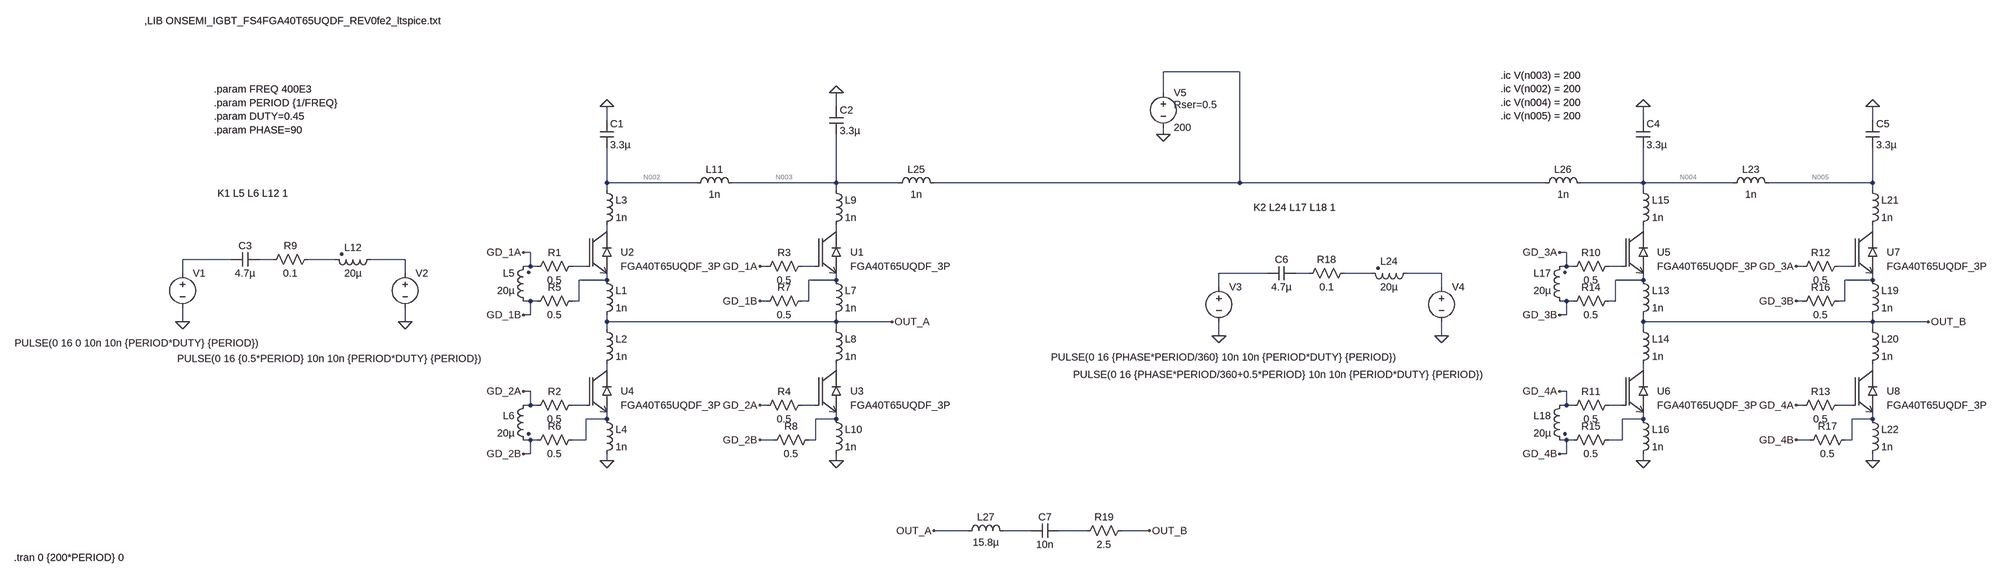
[diagram p0: schematic inverter.asc]
inverter.asc, the LTspice schematic file:
Version 4
SHEET 1 2984 848
WIRE 1264 -304 1088 -304
WIRE 1088 -256 1088 -304
WIRE 336 -224 336 -256
WIRE -192 -192 -192 -224
WIRE 2192 -192 2192 -224
WIRE 2720 -192 2720 -224
WIRE 1088 -160 1088 -176
WIRE -192 -48 -192 -128
WIRE 16 -48 -192 -48
WIRE 336 -48 336 -160
WIRE 336 -48 96 -48
WIRE 480 -48 336 -48
WIRE 1264 -48 1264 -304
WIRE 1264 -48 560 -48
WIRE 1968 -48 1264 -48
WIRE 2192 -48 2192 -128
WIRE 2192 -48 2048 -48
WIRE 2400 -48 2192 -48
WIRE 2720 -48 2720 -128
WIRE 2720 -48 2480 -48
WIRE -192 -32 -192 -48
WIRE 336 -32 336 -48
WIRE 2192 -32 2192 -48
WIRE 2720 -32 2720 -48
WIRE -192 64 -192 48
WIRE 336 64 336 48
WIRE 2192 64 2192 48
WIRE 2720 64 2720 48
WIRE -368 112 -384 112
WIRE 2016 112 2000 112
WIRE -1056 128 -1168 128
WIRE -960 128 -992 128
WIRE -816 128 -880 128
WIRE -656 128 -736 128
WIRE -368 144 -368 112
WIRE -368 144 -384 144
WIRE -352 144 -368 144
WIRE -240 144 -272 144
WIRE 176 144 160 144
WIRE 288 144 256 144
WIRE 2016 144 2016 112
WIRE 2016 144 2000 144
WIRE 2032 144 2016 144
WIRE 2144 144 2112 144
WIRE 2560 144 2544 144
WIRE 2672 144 2640 144
WIRE -1168 160 -1168 128
WIRE -656 160 -656 128
WIRE 1328 160 1216 160
WIRE 1424 160 1392 160
WIRE 1568 160 1504 160
WIRE 1728 160 1648 160
WIRE -192 176 -192 160
WIRE -192 176 -256 176
WIRE 336 176 336 160
WIRE 336 176 272 176
WIRE 2192 176 2192 160
WIRE 2192 176 2128 176
WIRE 2720 176 2720 160
WIRE 2720 176 2656 176
WIRE 1216 192 1216 160
WIRE 1728 192 1728 160
WIRE -368 224 -384 224
WIRE -352 224 -368 224
WIRE -256 224 -256 176
WIRE -256 224 -272 224
WIRE 176 224 160 224
WIRE 272 224 272 176
WIRE 272 224 256 224
WIRE 2016 224 2000 224
WIRE 2032 224 2016 224
WIRE 2128 224 2128 176
WIRE 2128 224 2112 224
WIRE 2560 224 2544 224
WIRE 2656 224 2656 176
WIRE 2656 224 2640 224
WIRE -368 256 -368 224
WIRE -368 256 -384 256
WIRE 2016 256 2016 224
WIRE 2016 256 2000 256
WIRE -1168 272 -1168 240
WIRE -656 272 -656 240
WIRE -192 272 -192 256
WIRE 336 272 336 256
WIRE 336 272 -192 272
WIRE 464 272 336 272
WIRE 2192 272 2192 256
WIRE 2720 272 2720 256
WIRE 2720 272 2192 272
WIRE 2848 272 2720 272
WIRE -192 288 -192 272
WIRE 336 288 336 272
WIRE 2192 288 2192 272
WIRE 2720 288 2720 272
WIRE 1216 304 1216 272
WIRE 1728 304 1728 272
WIRE -192 384 -192 368
WIRE 336 384 336 368
WIRE 2192 384 2192 368
WIRE 2720 384 2720 368
WIRE -368 432 -384 432
WIRE 2016 432 2000 432
WIRE -368 464 -368 432
WIRE -368 464 -384 464
WIRE -352 464 -368 464
WIRE -240 464 -272 464
WIRE 176 464 160 464
WIRE 288 464 256 464
WIRE 2016 464 2016 432
WIRE 2016 464 2000 464
WIRE 2032 464 2016 464
WIRE 2144 464 2112 464
WIRE 2560 464 2544 464
WIRE 2672 464 2640 464
WIRE -192 496 -192 480
WIRE -192 496 -240 496
WIRE 336 496 336 480
WIRE 336 496 288 496
WIRE 2192 496 2192 480
WIRE 2192 496 2144 496
WIRE 2720 496 2720 480
WIRE 2720 496 2672 496
WIRE -368 544 -384 544
WIRE -352 544 -368 544
WIRE -240 544 -240 496
WIRE -240 544 -272 544
WIRE 192 544 160 544
WIRE 288 544 288 496
WIRE 288 544 272 544
WIRE 2016 544 2000 544
WIRE 2032 544 2016 544
WIRE 2144 544 2144 496
WIRE 2144 544 2112 544
WIRE 2576 544 2544 544
WIRE 2672 544 2672 496
WIRE 2672 544 2656 544
WIRE -368 576 -368 544
WIRE -368 576 -384 576
WIRE 2016 576 2016 544
WIRE 2016 576 2000 576
WIRE -192 592 -192 576
WIRE 336 592 336 576
WIRE 2192 592 2192 576
WIRE 2720 592 2720 576
WIRE 640 768 560 768
WIRE 784 768 720 768
WIRE 912 768 848 768
WIRE 1056 768 992 768
FLAG -192 -224 0
FLAG -192 592 0
FLAG -384 112 GD_1A
FLAG -384 256 GD_1B
FLAG -384 432 GD_2A
FLAG -384 576 GD_2B
FLAG 336 -256 0
FLAG 336 592 0
FLAG 160 144 GD_1A
FLAG 160 224 GD_1B
FLAG 160 464 GD_2A
FLAG 160 544 GD_2B
FLAG -1168 272 0
FLAG -656 272 0
FLAG 2192 -224 0
FLAG 2192 592 0
FLAG 2000 112 GD_3A
FLAG 2000 256 GD_3B
FLAG 2000 432 GD_4A
FLAG 2000 576 GD_4B
FLAG 2720 -224 0
FLAG 2720 592 0
FLAG 2544 144 GD_3A
FLAG 2544 224 GD_3B
FLAG 2544 464 GD_4A
FLAG 2544 544 GD_4B
FLAG 1216 304 0
FLAG 1728 304 0
FLAG 464 272 OUT_A
FLAG 2848 272 OUT_B
FLAG 1088 -160 0
FLAG 560 768 OUT_A
FLAG 1056 768 OUT_B
SYMBOL FGA40T65UQDF_3P -240 144 R0
SYMATTR InstName U2
SYMBOL FGA40T65UQDF_3P -240 464 R0
SYMATTR InstName U4
SYMBOL ind -208 160 R0
SYMATTR InstName L1
SYMATTR Value 1n
SYMBOL ind -208 272 R0
SYMATTR InstName L2
SYMATTR Value 1n
SYMBOL ind -208 -48 R0
SYMATTR InstName L3
SYMATTR Value 1n
SYMBOL ind -208 480 R0
SYMATTR InstName L4
SYMATTR Value 1n
SYMBOL res -256 128 R90
WINDOW 0 0 56 VBottom 2
WINDOW 3 32 56 VTop 2
SYMATTR InstName R1
SYMATTR Value 0.5
SYMBOL res -256 448 R90
WINDOW 0 0 56 VBottom 2
WINDOW 3 32 56 VTop 2
SYMATTR InstName R2
SYMATTR Value 0.5
SYMBOL ind2 -368 240 R180
WINDOW 0 36 80 Left 2
WINDOW 3 36 40 Left 2
SYMATTR InstName L5
SYMATTR Value 20µ
SYMATTR Type ind
SYMBOL ind2 -368 448 M0
SYMATTR InstName L6
SYMATTR Value 20µ
SYMATTR Type ind
SYMBOL cap -208 -192 R0
SYMATTR InstName C1
SYMATTR Value 3.3µ
SYMATTR SpiceLine Rser=12.4m Lser=21n
SYMBOL FGA40T65UQDF_3P 288 144 R0
SYMATTR InstName U1
SYMBOL FGA40T65UQDF_3P 288 464 R0
SYMATTR InstName U3
SYMBOL ind 320 160 R0
SYMATTR InstName L7
SYMATTR Value 1n
SYMBOL ind 320 272 R0
SYMATTR InstName L8
SYMATTR Value 1n
SYMBOL ind 320 -48 R0
SYMATTR InstName L9
SYMATTR Value 1n
SYMBOL ind 320 480 R0
SYMATTR InstName L10
SYMATTR Value 1n
SYMBOL res 272 128 R90
WINDOW 0 0 56 VBottom 2
WINDOW 3 32 56 VTop 2
SYMATTR InstName R3
SYMATTR Value 0.5
SYMBOL res 272 448 R90
WINDOW 0 0 56 VBottom 2
WINDOW 3 32 56 VTop 2
SYMATTR InstName R4
SYMATTR Value 0.5
SYMBOL cap 320 -224 R0
SYMATTR InstName C2
SYMATTR Value 3.3µ
SYMATTR SpiceLine Rser=12.4m Lser=21n
SYMBOL res -256 208 R90
WINDOW 0 0 56 VBottom 2
WINDOW 3 32 56 VTop 2
SYMATTR InstName R5
SYMATTR Value 0.5
SYMBOL res -256 528 R90
WINDOW 0 0 56 VBottom 2
WINDOW 3 32 56 VTop 2
SYMATTR InstName R6
SYMATTR Value 0.5
SYMBOL res 272 208 R90
WINDOW 0 0 56 VBottom 2
WINDOW 3 32 56 VTop 2
SYMATTR InstName R7
SYMATTR Value 0.5
SYMBOL res 288 528 R90
WINDOW 0 0 56 VBottom 2
WINDOW 3 32 56 VTop 2
SYMATTR InstName R8
SYMATTR Value 0.5
SYMBOL ind 0 -32 R270
WINDOW 0 32 56 VTop 2
WINDOW 3 5 56 VBottom 2
SYMATTR InstName L11
SYMATTR Value 1n
SYMBOL ind2 -720 112 R90
WINDOW 0 4 56 VBottom 2
WINDOW 3 32 56 VTop 2
SYMATTR InstName L12
SYMATTR Value 20µ
SYMATTR Type ind
SYMBOL res -864 112 R90
WINDOW 0 0 56 VBottom 2
WINDOW 3 32 56 VTop 2
SYMATTR InstName R9
SYMATTR Value 0.1
SYMBOL cap -992 112 R90
WINDOW 0 0 32 VBottom 2
WINDOW 3 32 32 VTop 2
SYMATTR InstName C3
SYMATTR Value 4.7µ
SYMBOL voltage -1168 144 R0
WINDOW 3 -386 177 Left 2
WINDOW 123 0 0 Left 0
WINDOW 39 0 0 Left 0
SYMATTR InstName V1
SYMATTR Value PULSE(0 16 0 10n 10n {PERIOD*DUTY} {PERIOD})
SYMBOL voltage -656 144 R0
WINDOW 3 -524 213 Left 2
WINDOW 123 0 0 Left 0
WINDOW 39 0 0 Left 0
SYMATTR InstName V2
SYMATTR Value PULSE(0 16 {0.5*PERIOD} 10n 10n {PERIOD*DUTY} {PERIOD})
SYMBOL FGA40T65UQDF_3P 2144 144 R0
SYMATTR InstName U5
SYMBOL FGA40T65UQDF_3P 2144 464 R0
SYMATTR InstName U6
SYMBOL ind 2176 160 R0
SYMATTR InstName L13
SYMATTR Value 1n
SYMBOL ind 2176 272 R0
SYMATTR InstName L14
SYMATTR Value 1n
SYMBOL ind 2176 -48 R0
SYMATTR InstName L15
SYMATTR Value 1n
SYMBOL ind 2176 480 R0
SYMATTR InstName L16
SYMATTR Value 1n
SYMBOL res 2128 128 R90
WINDOW 0 0 56 VBottom 2
WINDOW 3 32 56 VTop 2
SYMATTR InstName R10
SYMATTR Value 0.5
SYMBOL res 2128 448 R90
WINDOW 0 0 56 VBottom 2
WINDOW 3 32 56 VTop 2
SYMATTR InstName R11
SYMATTR Value 0.5
SYMBOL ind2 2016 240 R180
WINDOW 0 36 80 Left 2
WINDOW 3 36 40 Left 2
SYMATTR InstName L17
SYMATTR Value 20µ
SYMATTR Type ind
SYMBOL ind2 2016 448 M0
SYMATTR InstName L18
SYMATTR Value 20µ
SYMATTR Type ind
SYMBOL cap 2176 -192 R0
SYMATTR InstName C4
SYMATTR Value 3.3µ
SYMATTR SpiceLine Rser=12.4m Lser=21n
SYMBOL FGA40T65UQDF_3P 2672 144 R0
SYMATTR InstName U7
SYMBOL FGA40T65UQDF_3P 2672 464 R0
SYMATTR InstName U8
SYMBOL ind 2704 160 R0
SYMATTR InstName L19
SYMATTR Value 1n
SYMBOL ind 2704 272 R0
SYMATTR InstName L20
SYMATTR Value 1n
SYMBOL ind 2704 -48 R0
SYMATTR InstName L21
SYMATTR Value 1n
SYMBOL ind 2704 480 R0
SYMATTR InstName L22
SYMATTR Value 1n
SYMBOL res 2656 128 R90
WINDOW 0 0 56 VBottom 2
WINDOW 3 32 56 VTop 2
SYMATTR InstName R12
SYMATTR Value 0.5
SYMBOL res 2656 448 R90
WINDOW 0 0 56 VBottom 2
WINDOW 3 32 56 VTop 2
SYMATTR InstName R13
SYMATTR Value 0.5
SYMBOL cap 2704 -192 R0
SYMATTR InstName C5
SYMATTR Value 3.3µ
SYMATTR SpiceLine Rser=12.4m Lser=21n
SYMBOL res 2128 208 R90
WINDOW 0 0 56 VBottom 2
WINDOW 3 32 56 VTop 2
SYMATTR InstName R14
SYMATTR Value 0.5
SYMBOL res 2128 528 R90
WINDOW 0 0 56 VBottom 2
WINDOW 3 32 56 VTop 2
SYMATTR InstName R15
SYMATTR Value 0.5
SYMBOL res 2656 208 R90
WINDOW 0 0 56 VBottom 2
WINDOW 3 32 56 VTop 2
SYMATTR InstName R16
SYMATTR Value 0.5
SYMBOL res 2672 528 R90
WINDOW 0 0 56 VBottom 2
WINDOW 3 32 56 VTop 2
SYMATTR InstName R17
SYMATTR Value 0.5
SYMBOL ind 2384 -32 R270
WINDOW 0 32 56 VTop 2
WINDOW 3 5 56 VBottom 2
SYMATTR InstName L23
SYMATTR Value 1n
SYMBOL ind2 1664 144 R90
WINDOW 0 4 56 VBottom 2
WINDOW 3 32 56 VTop 2
SYMATTR InstName L24
SYMATTR Value 20µ
SYMATTR Type ind
SYMBOL res 1520 144 R90
WINDOW 0 0 56 VBottom 2
WINDOW 3 32 56 VTop 2
SYMATTR InstName R18
SYMATTR Value 0.1
SYMBOL cap 1392 144 R90
WINDOW 0 0 32 VBottom 2
WINDOW 3 32 32 VTop 2
SYMATTR InstName C6
SYMATTR Value 4.7µ
SYMBOL voltage 1216 176 R0
WINDOW 3 -386 177 Left 2
WINDOW 123 0 0 Left 0
WINDOW 39 0 0 Left 0
SYMATTR InstName V3
SYMATTR Value PULSE(0 16 {PHASE*PERIOD/360} 10n 10n {PERIOD*DUTY} {PERIOD})
SYMBOL voltage 1728 176 R0
WINDOW 3 -847 217 Left 2
WINDOW 123 0 0 Left 0
WINDOW 39 0 0 Left 0
SYMATTR InstName V4
SYMATTR Value PULSE(0 16 {PHASE*PERIOD/360+0.5*PERIOD} 10n 10n {PERIOD*DUTY} {PERIOD})
SYMBOL ind 464 -32 R270
WINDOW 0 32 56 VTop 2
WINDOW 3 5 56 VBottom 2
SYMATTR InstName L25
SYMATTR Value 1n
SYMBOL ind 1952 -32 R270
WINDOW 0 32 56 VTop 2
WINDOW 3 5 56 VBottom 2
SYMATTR InstName L26
SYMATTR Value 1n
SYMBOL voltage 1088 -272 R0
WINDOW 123 0 0 Left 0
WINDOW 39 24 44 Left 2
SYMATTR InstName V5
SYMATTR Value 200
SYMATTR SpiceLine Rser=0.5
SYMBOL ind 624 784 R270
WINDOW 0 32 56 VTop 2
WINDOW 3 5 56 VBottom 2
SYMATTR InstName L27
SYMATTR Value 15.8µ
SYMBOL cap 848 752 R90
WINDOW 0 0 32 VBottom 2
WINDOW 3 32 32 VTop 2
SYMATTR InstName C7
SYMATTR Value 10n
SYMBOL res 1008 752 R90
WINDOW 0 0 56 VBottom 2
WINDOW 3 32 56 VTop 2
SYMATTR InstName R19
SYMATTR Value 2.5
TEXT -1088 -24 Left 2 !K1 L5 L6 L12 1
TEXT -1096 -264 Left 2 !.param FREQ 400E3\n.param PERIOD {1/FREQ}\n.param DUTY=0.45\n.param PHASE=90
TEXT 1296 8 Left 2 !K2 L24 L17 L18 1
TEXT -1556 830 Left 2 !.tran 0 {200*PERIOD} 0
TEXT -1256 -432 Left 2 !,LIB ONSEMI_IGBT_FS4FGA40T65UQDF_REV0fe2_ltspice.txt
TEXT 1864 -296 Left 2 !.ic V(n003) = 200\n.ic V(n002) = 200\n.ic V(n004) = 200\n.ic V(n005) = 200

The netlist it stands for:
* inverter.asc
XU2 N006 N014 N022 FGA40T65UQDF_3P  ; pins C G E
XU4 N026 N030 N034 FGA40T65UQDF_3P  ; pins C G E
L1 N022 OUT_A 1n
L2 OUT_A N026 1n
L3 N002 N006 1n
L4 N034 0 1n
R1 N014 GD_1A 0.5
R2 N030 GD_2A 0.5
L5 GD_1B GD_1A 20µ
L6 GD_2A GD_2B 20µ
C1 0 N002 3.3µ Rser=12.4m Lser=21n
XU1 N007 N015 N023 FGA40T65UQDF_3P  ; pins C G E
XU3 N027 N031 N035 FGA40T65UQDF_3P  ; pins C G E
L7 N023 OUT_A 1n
L8 OUT_A N027 1n
L9 N003 N007 1n
L10 N035 0 1n
R3 N015 GD_1A 0.5
R4 N031 GD_2A 0.5
C2 0 N003 3.3µ Rser=12.4m Lser=21n
R5 N022 GD_1B 0.5
R6 N034 GD_2B 0.5
R7 N023 GD_1B 0.5
R8 N035 GD_2B 0.5
L11 N002 N003 1n
L12 N013 N012 20µ
R9 N012 N011 0.1
C3 N011 N010 4.7µ
V1 N010 0 PULSE(0 16 0 10n 10n {PERIOD*DUTY} {PERIOD})
V2 N013 0 PULSE(0 16 {0.5*PERIOD} 10n 10n {PERIOD*DUTY} {PERIOD})
XU5 N008 N016 N024 FGA40T65UQDF_3P  ; pins C G E
XU6 N028 N032 N036 FGA40T65UQDF_3P  ; pins C G E
L13 N024 OUT_B 1n
L14 OUT_B N028 1n
L15 N004 N008 1n
L16 N036 0 1n
R10 N016 GD_3A 0.5
R11 N032 GD_4A 0.5
L17 GD_3B GD_3A 20µ
L18 GD_4A GD_4B 20µ
C4 0 N004 3.3µ Rser=12.4m Lser=21n
XU7 N009 N017 N025 FGA40T65UQDF_3P  ; pins C G E
XU8 N029 N033 N037 FGA40T65UQDF_3P  ; pins C G E
L19 N025 OUT_B 1n
L20 OUT_B N029 1n
L21 N005 N009 1n
L22 N037 0 1n
R12 N017 GD_3A 0.5
R13 N033 GD_4A 0.5
C5 0 N005 3.3µ Rser=12.4m Lser=21n
R14 N024 GD_3B 0.5
R15 N036 GD_4B 0.5
R16 N025 GD_3B 0.5
R17 N037 GD_4B 0.5
L23 N004 N005 1n
L24 N021 N020 20µ
R18 N020 N019 0.1
C6 N019 N018 4.7µ
V3 N018 0 PULSE(0 16 {PHASE*PERIOD/360} 10n 10n {PERIOD*DUTY} {PERIOD})
V4 N021 0 PULSE(0 16 {PHASE*PERIOD/360+0.5*PERIOD} 10n 10n {PERIOD*DUTY} {PERIOD})
L25 N003 N001 1n
L26 N001 N004 1n
V5 N001 0 200 Rser=0.5
L27 OUT_A N038 15.8µ
C7 N039 N038 10n
R19 OUT_B N039 2.5
K1 L5 L6 L12 1
.param FREQ 400E3
.param PERIOD {1/FREQ}
.param DUTY=0.45
.param PHASE=90
K2 L24 L17 L18 1
.tran 0 {200*PERIOD} 0
,LIB ONSEMI_IGBT_FS4FGA40T65UQDF_REV0fe2_ltspice.txt
.ic V(n003) = 200
.ic V(n002) = 200
.ic V(n004) = 200
.ic V(n005) = 200
.backanno
.end